# Altium schematic sheet MIPI_DSI_TP.SchDoc
size A3; SheetNumber: 9; SheetTotal: 20
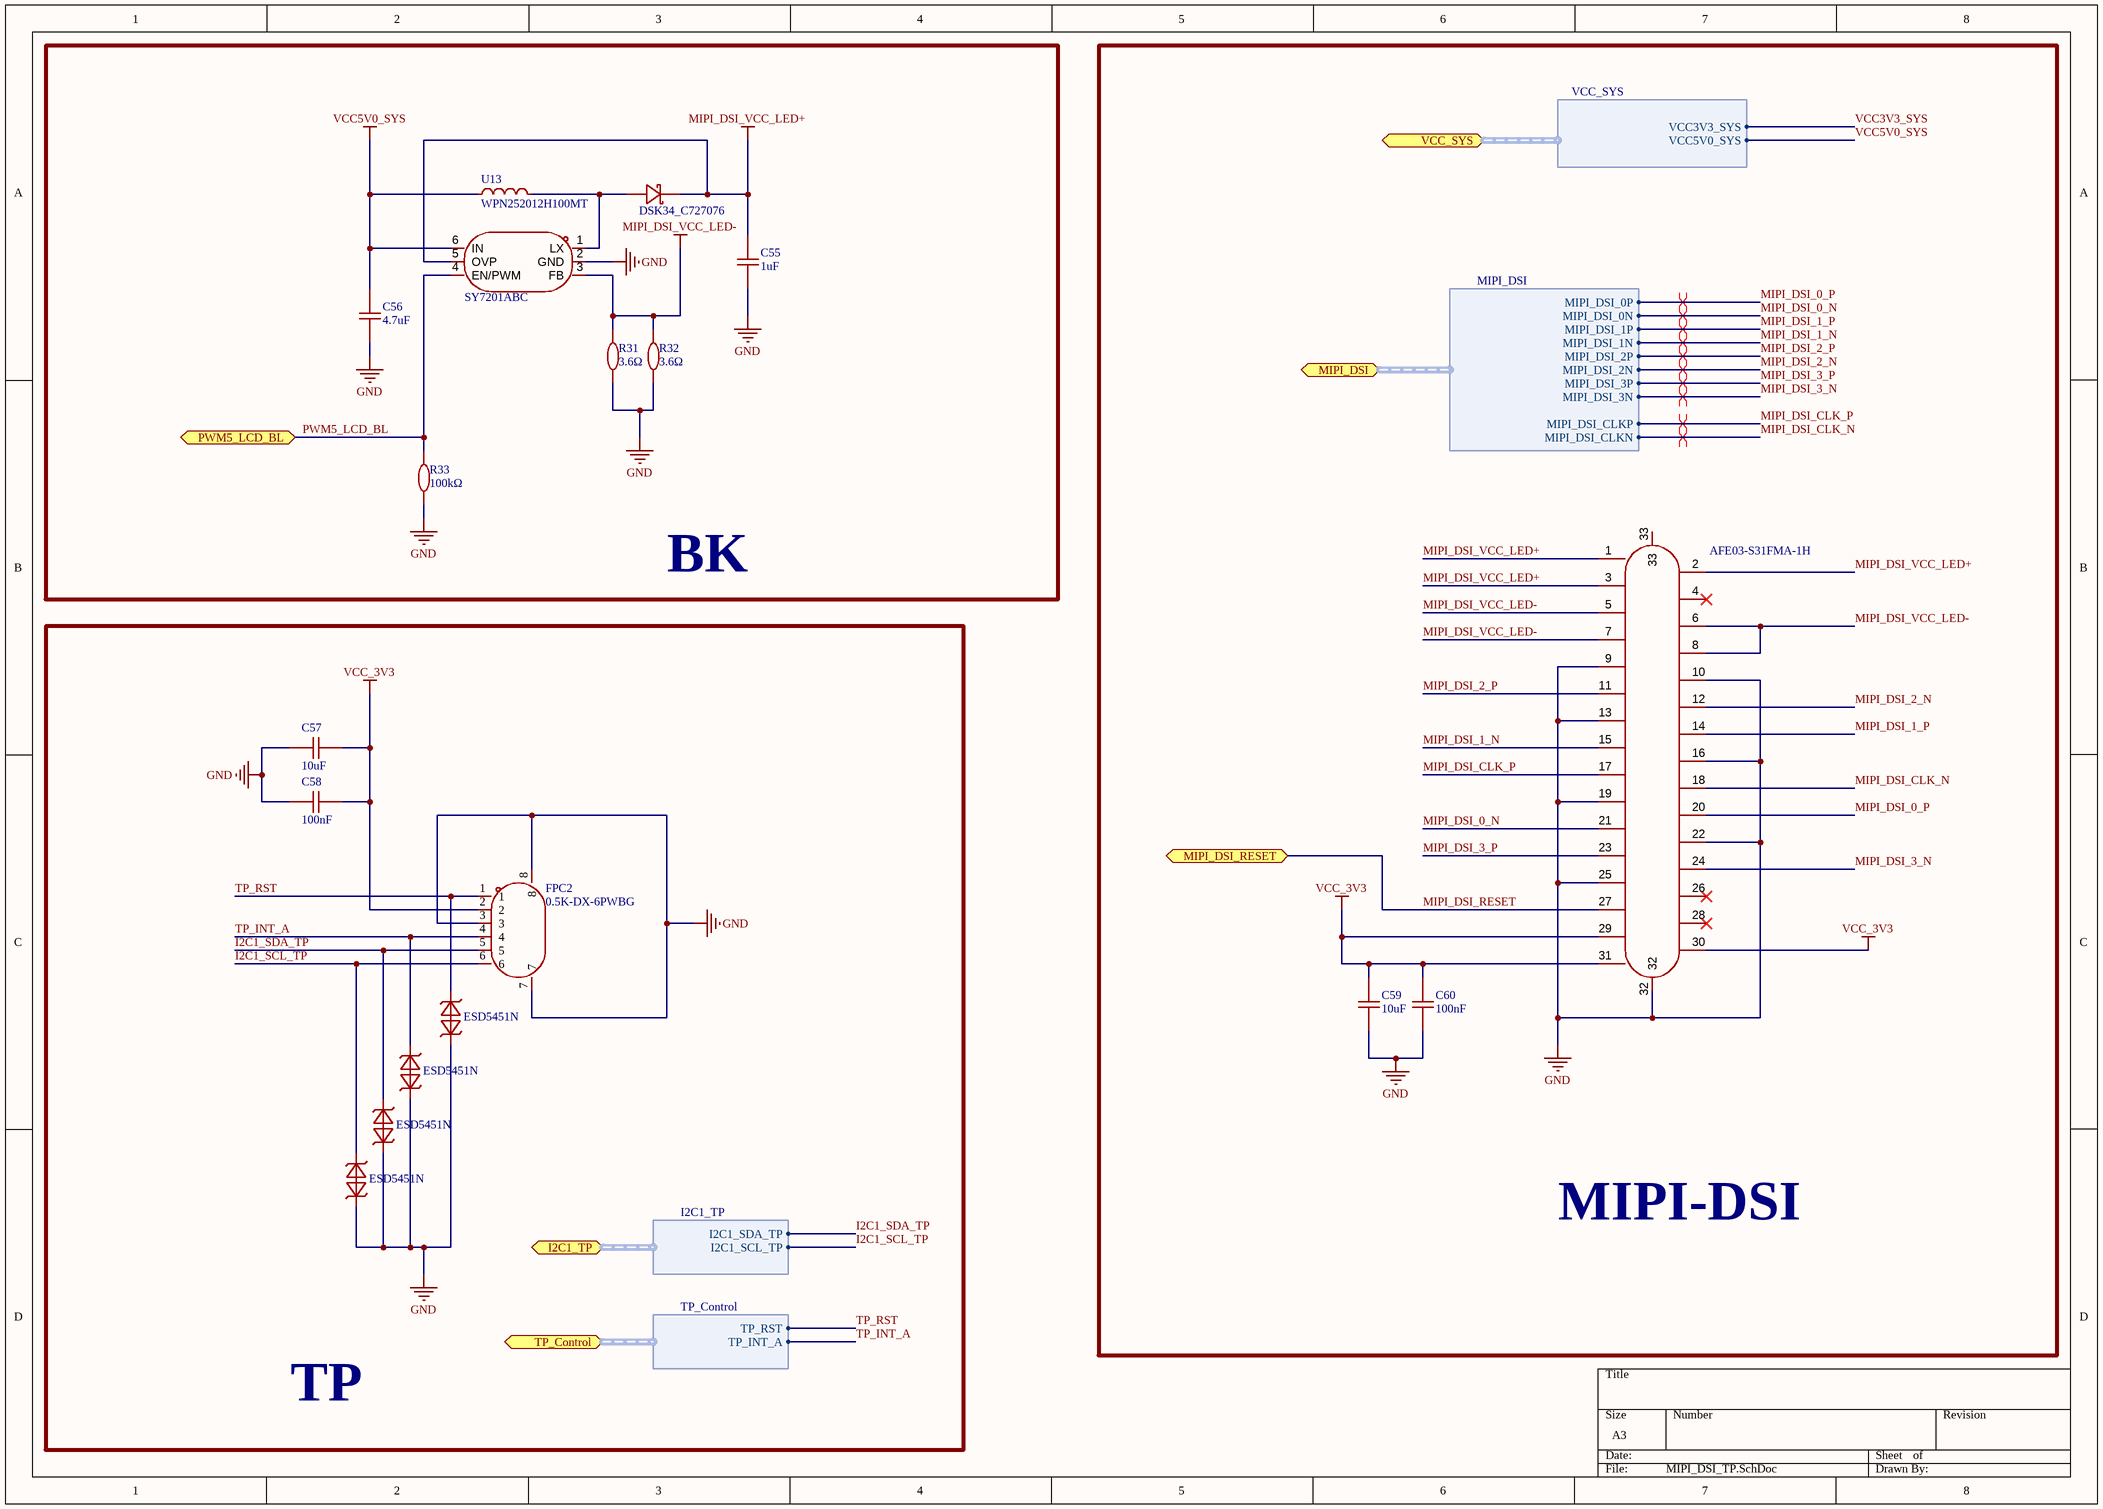
[diagram p0: MIPI_DSI_TP.SchDoc]

## Parts
C55  1uF  [C0402]
C56  4.7uF  [C0402]
C57  10uF  [C0603]
C58  100nF  [C0402]
C59  10uF  [C0603]
C60  100nF  [C0402]
D8  DSK34_C727076  [SOD-323_L1.8-W1.3-LS2.5-RD]
FPC1  AFE03-S31FMA-1H  [FPC-SMD_P0.30-31P_FGS-XJ-H1.0]
FPC2  0.5K-DX-6PWBG  [FPC-SMD_6P-P0.50_DEALON_0.5K-DX-6PWB]
R31  3.6Ω  [R0603]
R32  3.6Ω  [R0603]
R33  100kΩ  [R0402]
U13  WPN252012H100MT  [IND-SMD_L2.5-W2.0_WPN252012H]
U14  SY7201ABC  [SOT-23-6_L2.9-W1.6-P0.95-LS2.8-BR]
U15  ESD5451N  [DFN1006-2L-BI]
U16  ESD5451N  [DFN1006-2L-BI]
U17  ESD5451N  [DFN1006-2L-BI]
U18  ESD5451N  [DFN1006-2L-BI]

## Blocks framed on the sheet
BK: C55 C56 D8 R31-R33 U13 U14
MIPI-DSI: C59 C60 FPC1
TP: C57 C58 FPC2 U15-U18

## Ports
I2C1_TP (bidir, harness I2C1_TP, see Overview[2C], RK3566[3C], RK3566_OSC_PLL_PMUO1_2[1A]), MIPI_DSI (bidir, harness MIPI_DSI, see Overview[2C], RK3566[3B], RK3566_MIPI_HDMI[5A]), MIPI_DSI_RESET (bidir, see Overview[2C], RK3566[3C], RK3566_USB_GPIO[5B]), PWM5_LCD_BL (bidir, see Overview[2C], RK3566[3D], RK3566_OSC_PLL_PMUO1_2[7C]), TP_Control (bidir, harness TP_Control, see Overview[2C], RK3566[3B], RK3566_FLASH_SD_SARADC[7B]), VCC_SYS (bidir, harness VCC_SYS, see Overview[2C], Audio_AND_HPJ[3A], DEBUG_AND_GPIO[1D], HDMI[2C], POWER[3B], POWER[6B], POWER_EXTENSION[4D], POWER_FLASH_POWER_MANAGE[3C], POWER_PMIC[6D], Wi-Fi_BT[3D])

## Harnesses
MIPI_DSI: MIPI_DSI_0P, MIPI_DSI_0N, MIPI_DSI_1P, MIPI_DSI_1N, MIPI_DSI_2P, MIPI_DSI_2N, MIPI_DSI_CLKP, MIPI_DSI_3P, MIPI_DSI_3N, MIPI_DSI_CLKN
I2C1_TP: I2C1_SDA_TP, I2C1_SCL_TP
TP_Control: TP_RST, TP_INT_A
VCC_SYS: VCC3V3_SYS, VCC5V0_SYS

## Nets
GND: C55.1 C56.1 C57.1 C58.1 C59.1 C60.1 FPC1.9 FPC1.10 FPC1.13 FPC1.16 FPC1.19 FPC1.22 FPC1.25 FPC1.32 FPC2.3 FPC2.7 FPC2.8 R31.1 R32.1 R33.1 U14.2(GND) U15.1 U16.1 U17.1 U18.1
MIPI_DSI_VCC_LED+: C55.2 D8.1(K) FPC1.1 FPC1.2 FPC1.3 U14.5(OVP)
MIPI_DSI_VCC_LED-: FPC1.5 FPC1.6 FPC1.7 FPC1.8 R31.2 R32.2 U14.3(FB)
VCC5V0_SYS: C56.2 U13.1 U14.6(IN) ; port VCC_SYS.VCC5V0_SYS
VCC_3V3: C57.2 C58.2 C59.2 C60.2 FPC1.29 FPC1.30 FPC1.31 FPC2.2
I2C1_SCL_TP: FPC2.6 U18.2 ; port I2C1_TP.I2C1_SCL_TP
I2C1_SDA_TP: FPC2.5 U17.2 ; port I2C1_TP.I2C1_SDA_TP
MIPI_DSI_0_N: FPC1.21 ; port MIPI_DSI.MIPI_DSI_0N
MIPI_DSI_0_P: FPC1.20 ; port MIPI_DSI.MIPI_DSI_0P
MIPI_DSI_1_N: FPC1.15 ; port MIPI_DSI.MIPI_DSI_1N
MIPI_DSI_1_P: FPC1.14 ; port MIPI_DSI.MIPI_DSI_1P
MIPI_DSI_2_N: FPC1.12 ; port MIPI_DSI.MIPI_DSI_2N
MIPI_DSI_2_P: FPC1.11 ; port MIPI_DSI.MIPI_DSI_2P
MIPI_DSI_3_N: FPC1.24 ; port MIPI_DSI.MIPI_DSI_3N
MIPI_DSI_3_P: FPC1.23 ; port MIPI_DSI.MIPI_DSI_3P
MIPI_DSI_CLK_N: FPC1.18 ; port MIPI_DSI.MIPI_DSI_CLKN
MIPI_DSI_CLK_P: FPC1.17 ; port MIPI_DSI.MIPI_DSI_CLKP
MIPI_DSI_RESET: FPC1.27 ; port MIPI_DSI_RESET
PWM5_LCD_BL: R33.2 U14.4(EN/PWM) ; port PWM5_LCD_BL
TP_INT_A: FPC2.4 U16.2 ; port TP_Control.TP_INT_A
TP_RST: FPC2.1 U15.2 ; port TP_Control.TP_RST
VCC3V3_SYS: port VCC_SYS.VCC3V3_SYS
NetD8_2: D8.2(A) U13.2 U14.1(LX)

Not connected (* = marked no-connect by the designer): FPC1 4* 26* 28* 33

## Layout directives
differential pair: MIPI_DSI_0_N, MIPI_DSI_0_P, MIPI_DSI_1_N, MIPI_DSI_1_P, MIPI_DSI_2_N, MIPI_DSI_2_P, MIPI_DSI_3_N, MIPI_DSI_3_P, MIPI_DSI_CLK_N, MIPI_DSI_CLK_P

## Library data of the parts
C55 = 1uF: 50V 1uF X5R ±10% 0402 Ceramic Capacitors ROHS
C56 = 4.7uF: 10V 4.7uF X5R ±20% 0402 Ceramic Capacitors ROHS
C57 C59 = 10uF: 10V 10uF X5R ±10% 0603 Ceramic Capacitors ROHS
C58 C60 = 100nF: 50V 100nF X7R ±10% 0402 Ceramic Capacitors ROHS
D8 = DSK34_C727076: 特性：塑料封装符合UL 94V-0阻燃等级。 适用于表面贴装应用。 金属硅结，多数载流子传导。 低功耗，高效率。 内置应力消除，适合自动贴装。 高正向浪涌电流能力。 保证高温焊接：端子处250℃/10秒; Symbol: DSK34_C727076
FPC1 = AFE03-S31FMA-1H: FPC SMD,P=0.3mm,卧贴; Symbol: AFE03-S31FMA-1H
R31 R32 = 3.6Ω: 0603 3.6Ω ±1% 100mW 厚膜电阻
R33 = 100kΩ: 100kΩ 62.5mW 50V ±100ppm/℃ Thick Film Resistor ±1% 0402 Chip Resistor - Surface Mount ROHS
U13 = WPN252012H100MT: 10uH
U14 = SY7201ABC: 是一款DC/DC升压转换器，可为驱动LED提供精确的恒定电流。以1MHz的固定开关频率运行，允许该器件与小值外部陶瓷电容器和电感器一起使用。通过外部电阻器设置的调节电流驱动串联连接的LED，非常适合驱动多达八个串联的白色LED或高达30V的LED。; Symbol: SY7201ABC
U15-U18 = ESD5451N: 是双向 TVS（瞬态电压抑制器），专门用于保护连接到低速数据线和控制线的敏感电子元件，使其免受 ESD（静电放电）、EFT（电快速瞬变）和浪涌引起的过应力影响。; Symbol: ESD5451N